# Altium schematic sheet Main.SchDoc
size 420 x 297 mm; Revision: 0; SheetNumber: 1; SheetTotal: 10; Номер листа: 1; Общее количество листов: 10; Наименование изделия 1: QFP Main; Наименование изделия 2: Схема электрическая; Наименование изделия 3: принципиальная
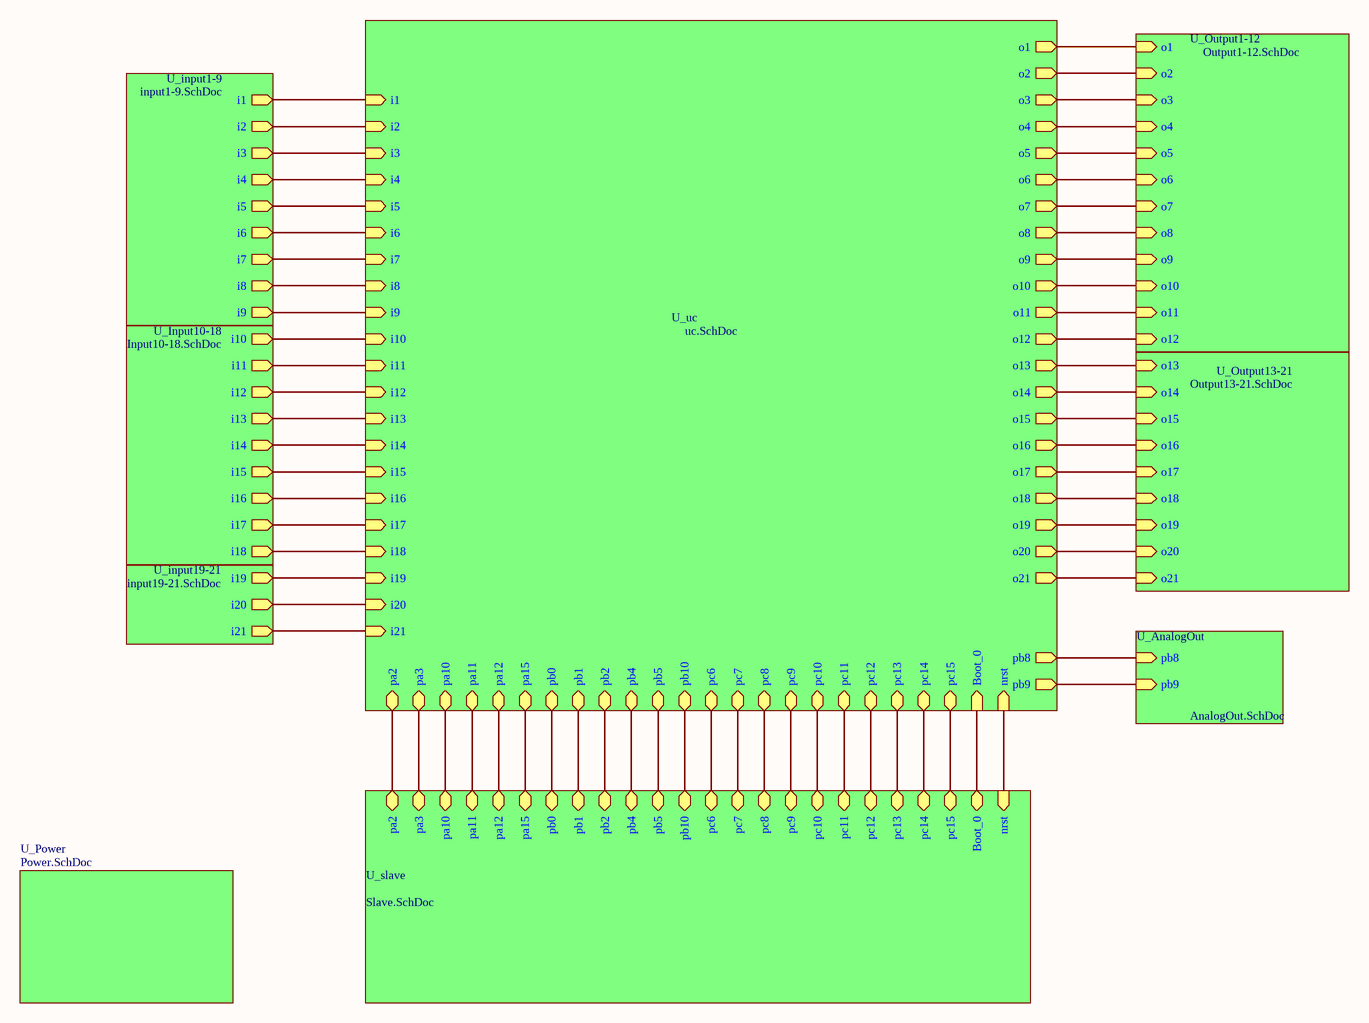
[diagram p0: Main.SchDoc]

## Sub-sheets
U_AnalogOut = AnalogOut.SchDoc: pb8 (in), pb9 (in)
U_input1-9 = input1-9.SchDoc: i2 (out), i3 (out), i1 (out), i5 (out), i6 (out), i4 (out), i8 (out), i9 (out), i7 (out)
U_Input10-18 = Input10-18.SchDoc: i17 (out), i18 (out), i16 (out), i14 (out), i15 (out), i13 (out), i11 (out), i12 (out), i10 (out)
U_input19-21 = input19-21.SchDoc: i20 (out), i21 (out), i19 (out)
U_Output1-12 = Output1-12.SchDoc: o1 (in), o2 (in), o3 (in), o4 (in), o5 (in), o6 (in), o7 (in), o8 (in), o9 (in), o10 (in), o11 (in), o12 (in)
U_Output13-21 = Output13-21.SchDoc: o13 (in), o14 (in), o15 (in), o16 (in), o17 (in), o18 (in), o19 (in), o20 (in), o21 (in)
U_Power = Power.SchDoc: no entries
U_slave = Slave.SchDoc: pa10 (bidir), pa11 (bidir), pa12 (bidir), pa15 (bidir), pb0 (bidir), pb1 (bidir), pb2 (bidir), pb4 (bidir), pb5 (bidir), pb10 (bidir), pс6 (bidir), pс7 (bidir), pс8 (bidir), pс9 (bidir), pс10 (bidir), pс11 (bidir), pс12 (bidir), pс13 (bidir), pс14 (bidir), pс15 (bidir), Вооt_0 (bidir), nrst (in), pa3 (bidir), pa2 (bidir)
U_uc = uc.SchDoc: Вооt_0 (in), nrst (in), i1 (in), i2 (in), i3 (in), i4 (in), i5 (in), i6 (in), i7 (in), i8 (in), i9 (in), i10 (in), i11 (in), i12 (in), i13 (in), i14 (in), i15 (in), i16 (in), i17 (in), i18 (in), i19 (in), i20 (in), i21 (in), pb8 (out), o2 (out), o3 (out), o4 (out), o5 (out), o6 (out), o7 (out), o8 (out), o9 (out), o10 (out), o11 (out), o12 (out), o13 (out), o14 (out), o15 (out), o16 (out), o17 (out), o18 (out), o19 (out), o20 (out), o21 (out), pa10 (bidir), pa11 (bidir), pa12 (bidir), pa15 (bidir), pb0 (bidir), pb1 (bidir), pb2 (bidir), pb4 (bidir), pb10 (bidir), pс6 (bidir), pс7 (bidir), pс8 (bidir), pс9 (bidir), pс10 (bidir), pс11 (bidir), pс12 (bidir), pс13 (bidir), pс14 (bidir), pс15 (bidir), pa3 (bidir), pa2 (bidir), pb9 (out), o1 (out), pb5 (bidir)

## Nets
(unnamed): sheet U_input1-9/i2, sheet U_uc/i2
(unnamed): sheet U_input1-9/i3, sheet U_uc/i3
(unnamed): sheet U_input1-9/i1, sheet U_uc/i1
(unnamed): sheet U_input1-9/i5, sheet U_uc/i5
(unnamed): sheet U_input1-9/i6, sheet U_uc/i6
(unnamed): sheet U_input1-9/i4, sheet U_uc/i4
(unnamed): sheet U_input1-9/i8, sheet U_uc/i8
(unnamed): sheet U_input1-9/i9, sheet U_uc/i9
(unnamed): sheet U_input1-9/i7, sheet U_uc/i7
(unnamed): sheet U_Input10-18/i17, sheet U_uc/i17
(unnamed): sheet U_Input10-18/i18, sheet U_uc/i18
(unnamed): sheet U_Input10-18/i16, sheet U_uc/i16
(unnamed): sheet U_Input10-18/i14, sheet U_uc/i14
(unnamed): sheet U_Input10-18/i15, sheet U_uc/i15
(unnamed): sheet U_Input10-18/i13, sheet U_uc/i13
(unnamed): sheet U_Input10-18/i11, sheet U_uc/i11
(unnamed): sheet U_Input10-18/i12, sheet U_uc/i12
(unnamed): sheet U_Input10-18/i10, sheet U_uc/i10
(unnamed): sheet U_input19-21/i20, sheet U_uc/i20
(unnamed): sheet U_input19-21/i21, sheet U_uc/i21
(unnamed): sheet U_input19-21/i19, sheet U_uc/i19
(unnamed): sheet U_AnalogOut/pb8, sheet U_uc/pb8
(unnamed): sheet U_AnalogOut/pb9, sheet U_uc/pb9
(unnamed): sheet U_slave/pa10, sheet U_uc/pa10
(unnamed): sheet U_slave/pa11, sheet U_uc/pa11
(unnamed): sheet U_slave/pa12, sheet U_uc/pa12
(unnamed): sheet U_slave/pa15, sheet U_uc/pa15
(unnamed): sheet U_slave/pb0, sheet U_uc/pb0
(unnamed): sheet U_slave/pb1, sheet U_uc/pb1
(unnamed): sheet U_slave/pb2, sheet U_uc/pb2
(unnamed): sheet U_slave/pb4, sheet U_uc/pb4
(unnamed): sheet U_slave/pb5, sheet U_uc/pb5
(unnamed): sheet U_slave/pb10, sheet U_uc/pb10
(unnamed): sheet U_slave/pс6, sheet U_uc/pс6
(unnamed): sheet U_slave/pс7, sheet U_uc/pс7
(unnamed): sheet U_slave/pс8, sheet U_uc/pс8
(unnamed): sheet U_slave/pс9, sheet U_uc/pс9
(unnamed): sheet U_slave/pс10, sheet U_uc/pс10
(unnamed): sheet U_slave/pс11, sheet U_uc/pс11
(unnamed): sheet U_slave/pс12, sheet U_uc/pс12
(unnamed): sheet U_slave/pс13, sheet U_uc/pс13
(unnamed): sheet U_slave/pс14, sheet U_uc/pс14
(unnamed): sheet U_slave/pс15, sheet U_uc/pс15
(unnamed): sheet U_slave/Вооt_0, sheet U_uc/Вооt_0
(unnamed): sheet U_slave/nrst, sheet U_uc/nrst
(unnamed): sheet U_slave/pa3, sheet U_uc/pa3
(unnamed): sheet U_slave/pa2, sheet U_uc/pa2
(unnamed): sheet U_uc/o2, sheet U_Output1-12/o2
(unnamed): sheet U_uc/o3, sheet U_Output1-12/o3
(unnamed): sheet U_uc/o4, sheet U_Output1-12/o4
(unnamed): sheet U_uc/o5, sheet U_Output1-12/o5
(unnamed): sheet U_uc/o6, sheet U_Output1-12/o6
(unnamed): sheet U_uc/o7, sheet U_Output1-12/o7
(unnamed): sheet U_uc/o8, sheet U_Output1-12/o8
(unnamed): sheet U_uc/o9, sheet U_Output1-12/o9
(unnamed): sheet U_uc/o10, sheet U_Output1-12/o10
(unnamed): sheet U_uc/o11, sheet U_Output1-12/o11
(unnamed): sheet U_uc/o12, sheet U_Output1-12/o12
(unnamed): sheet U_uc/o13, sheet U_Output13-21/o13
(unnamed): sheet U_uc/o14, sheet U_Output13-21/o14
(unnamed): sheet U_uc/o15, sheet U_Output13-21/o15
(unnamed): sheet U_uc/o16, sheet U_Output13-21/o16
(unnamed): sheet U_uc/o17, sheet U_Output13-21/o17
(unnamed): sheet U_uc/o18, sheet U_Output13-21/o18
(unnamed): sheet U_uc/o19, sheet U_Output13-21/o19
(unnamed): sheet U_uc/o20, sheet U_Output13-21/o20
(unnamed): sheet U_uc/o21, sheet U_Output13-21/o21
(unnamed): sheet U_uc/o1, sheet U_Output1-12/o1

## Notes on the sheet
- Перв. примен.
- Справ. №
- Подп. и дата
- Инв. № дубл.
- Взам. инв. №
- Разраб.
- Изм.
- Лист
- № докум.
- Подп.
- Дата
- Лит.
- Масса
- Масштаб
- Пров.
- Т.контр.
- Листов
- Инв. № подл.
- Утв.
- Н.контр.
- Копировал
- Формат А3